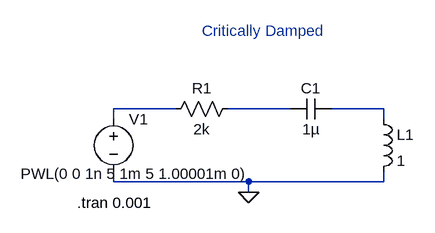
[diagram p0: schematic Critically Damped LCR Circuit.asc]
Critically Damped LCR Circuit.asc, the LTspice schematic file:
Version 4
SHEET 1 880 680
WIRE 112 128 16 128
WIRE 288 128 192 128
WIRE 432 128 352 128
WIRE 16 144 16 128
WIRE 432 144 432 128
WIRE 16 240 16 224
WIRE 224 240 16 240
WIRE 432 240 432 224
WIRE 432 240 224 240
WIRE 224 256 224 240
FLAG 224 256 0
SYMBOL ind 416 128 R0
SYMATTR InstName L1
SYMATTR Value 1
SYMBOL res 208 112 R90
WINDOW 0 0 56 VBottom 2
WINDOW 3 32 56 VTop 2
SYMATTR InstName R1
SYMATTR Value 2k
SYMBOL cap 352 112 R90
WINDOW 0 0 32 VBottom 2
WINDOW 3 32 32 VTop 2
SYMATTR InstName C1
SYMATTR Value 1µ
SYMBOL voltage 16 128 R0
WINDOW 3 -143 100 Left 2
WINDOW 123 0 0 Left 0
WINDOW 39 0 0 Left 0
SYMATTR Value PWL(0 0 1n 5 1m 5 1.00001m 0)
SYMATTR InstName V1
TEXT -40 272 Left 2 !.tran 0.001
TEXT 152 8 Left 2 ;Critically Damped

The netlist it stands for:
* Critically Damped LCR Circuit.asc
L1 N003 0 1
R1 N002 N001 2k
C1 N003 N002 1µ
V1 N001 0 PWL(0 0 1n 5 1m 5 1.00001m 0)
.tran 0.001
* Critically Damped
.backanno
.end